# Altium schematic sheet ERN_MainPowerV2.SchDoc
size A; SheetNumber: 1; SheetTotal: 2; SPICEModelCacheJSZPDIHS: <root> / <DocumentId>JSZPDIHS</DocumentId> / <CacheFrame Number="0"> / <Model Name="irf1010" Kind="CKT"> / <Text>*IRF1010 MCE 4-2-96 / *55V  75A .014 ohm HEXFET pkg:TO-220 2,1,3 / .SUBCKT IRF1010  10 20 40 40 / M1   1  2  3  3  DMOS L=1U W=1U / RD  10  1  5.65M / RS  30  3  1.35M / RG  20  2  12.1 / CGS  2  3  2.15N / EGD 12  0  2  1  1 / VFB 14  0  0 / FFB  2  1  VFB  1 / CGD 13 14  4.49N / R1  13  0  1 / D1  12 13  DLIM / DDG 15 14  DCGD / R2  12 15  1 / D2  15  0  DLIM / DSD  3 10  DSUB / LS  30 40  7.5N / .MODEL DMOS NMOS (LEVEL=3 THETA=60M VMAX=114K ETA=2M VTO=3 KP=19.4) / .MODEL DCGD D (CJO=4.49N VJ=.6 M=.68) / .MODEL DSUB D (IS=311N N=1.5 RS=8.67M BV=55 CJO=4.08N VJ=.8 M=.42 TT=100N) / .MODEL DLIM D (IS=100U) / .ENDS IRF1010</Text> / </Model> / <Model Name="led2" Kind="MDL"> / <Text>*Typ RED,GREEN,YELLOW,AMBER GaAs LED: Vf=2.1V Vr=4V If=40mA trr=3uS / *LED Pinout: 1=A, 2=K / .MODEL LED2 D (IS=93.1P RS=42M N=4.61 BV=4 IBV=10U / + CJO=2.97P VJ=.75 M=.333 TT=4.32U)</Text> / </Model> / </CacheFrame> / </root>
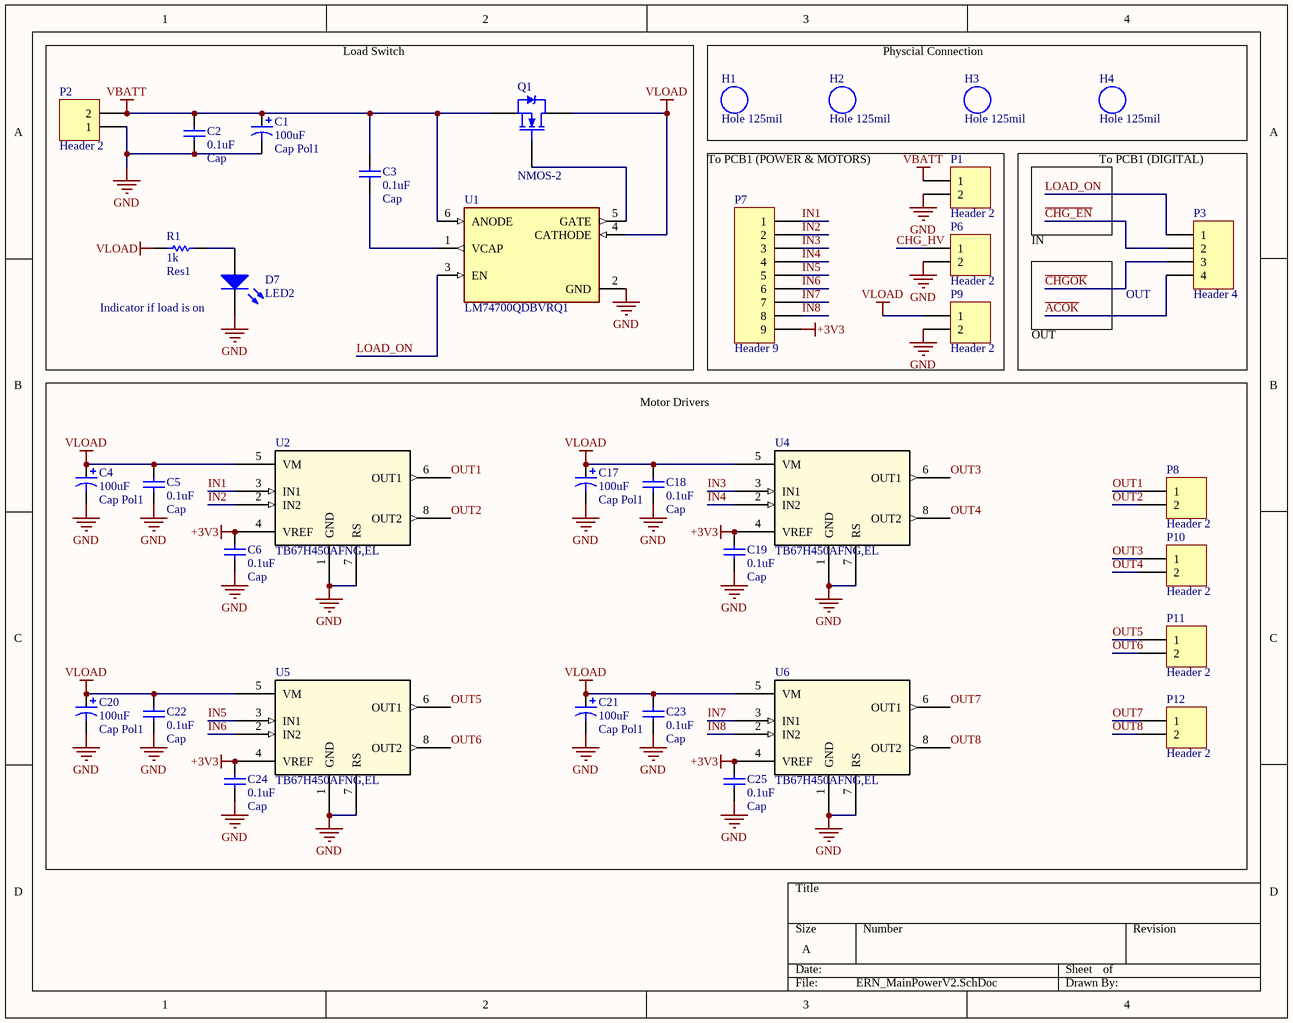
[diagram p0: ERN_MainPowerV2.SchDoc]

## Parts
C1  Cap Pol1  value 100uF  [Cap_47uF_100uF]
C2  Cap  value 0.1uF  [RAD-0.3]
C3  Cap  value 0.1uF  [C0805]
C4  Cap Pol1  value 100uF  [Cap_47uF_100uF]
C5  Cap  value 0.1uF  [C0805]
C6  Cap  value 0.1uF  [RAD-0.3]
C17  Cap Pol1  value 100uF  [Cap_47uF_100uF]
C18  Cap  value 0.1uF  [C0805]
C19  Cap  value 0.1uF  [RAD-0.3]
C20  Cap Pol1  value 100uF  [Cap_47uF_100uF]
C21  Cap Pol1  value 100uF  [Cap_47uF_100uF]
C22  Cap  value 0.1uF  [C0805]
C23  Cap  value 0.1uF  [C0805]
C24  Cap  value 0.1uF  [RAD-0.3]
C25  Cap  value 0.1uF  [RAD-0.3]
D7  LED2  [led-0]
H1  Hole 125mil  [Hole 125mil]
H2  Hole 125mil  [Hole 125mil]
H3  Hole 125mil  [Hole 125mil]
H4  Hole 125mil  [Hole 125mil]
P1  Header 2  [HDR1X2]
P2  Header 2  [HDR1X2]
P3  Header 4  [HDR1X4]
P6  Header 2  [HDR1X2]
P7  Header 9  [HDR1X9]
P8  Header 2  [HDR1X2]
P9  Header 2  [HDR1X2]
P10  Header 2  [HDR1X2]
P11  Header 2  [HDR1X2]
P12  Header 2  [HDR1X2]
Q1  NMOS-2  [TO-220AB]
R1  Res1  value 1k  [AXIAL-0.3]
U1  LM74700QDBVRQ1  [SOT95P280X145-6N]
U2  TB67H450AFNG,EL  [P-HSOP8-0405-1.27-002_TOS]
U4  TB67H450AFNG,EL  [P-HSOP8-0405-1.27-002_TOS]
U5  TB67H450AFNG,EL  [P-HSOP8-0405-1.27-002_TOS]
U6  TB67H450AFNG,EL  [P-HSOP8-0405-1.27-002_TOS]

## Blocks framed on the sheet
Physcial Connection: H1-H4
To PCB1 (POWER & MOTORS): P1 P6 P7 P9
Motor Drivers: C4-C6 C17-C25 P8 P10-P12 U2 U4-U6

## Nets
+3V3: C6.2 C19.2 C24.2 C25.2 P7.9 U2.4(VREF) U4.4(VREF) U5.4(VREF) U6.4(VREF)
GND: C1.2 C2.1 C4.2 C5.1 C6.1 C17.2 C18.1 C19.1 C20.2 C21.2 C22.1 C23.1 C24.1 C25.1 D7.2(K) P1.2 P2.1 P6.2 P9.2 U1.2(GND) U2.1(GND) U2.7(RS) U4.1(GND) U4.7(RS) U5.1(GND) U5.7(RS) U6.1(GND) U6.7(RS)
VBATT: C1.1 C2.2 C3.2 P1.1 P2.2 Q1.3(S) U1.6(ANODE)
VLOAD: C4.1 C5.2 C17.1 C18.2 C20.1 C21.1 C22.2 C23.2 P9.1 Q1.2(D) R1.1 U1.4(CATHODE) U2.5(VM) U4.5(VM) U5.5(VM) U6.5(VM)
~{ACOK}: P3.4
~{CHG_EN}: P3.2
~{CHGOK}: P3.3
CHG_HV: P6.1
IN1: P7.1 U2.3(IN1)
IN2: P7.2 U2.2(IN2)
IN3: P7.3 U4.3(IN1)
IN4: P7.4 U4.2(IN2)
IN5: P7.5 U5.3(IN1)
IN6: P7.6 U5.2(IN2)
IN7: P7.7 U6.3(IN1)
IN8: P7.8 U6.2(IN2)
LOAD_ON: P3.1 U1.3(EN)
OUT1: P8.1 U2.6(OUT1)
OUT2: P8.2 U2.8(OUT2)
OUT3: P10.1 U4.6(OUT1)
OUT4: P10.2 U4.8(OUT2)
OUT5: P11.1 U5.6(OUT1)
OUT6: P11.2 U5.8(OUT2)
OUT7: P12.1 U6.6(OUT1)
OUT8: P12.2 U6.8(OUT2)
NetC3_1: C3.1 U1.1(VCAP)
NetD7_1: D7.1(A) R1.2
NetQ1_1: Q1.1(G) U1.5(GATE)

## Notes on the sheet
- Load Switch
- To PCB1 (DIGITAL)
- IN
- (near P3) OUT
- (near D7) Indicator if load is on
- OUT

## Library data of the parts
C1 C4 C17 C20 C21 = Cap Pol1: Polarized Capacitor (Radial); Published: 8-Jun-2000; LatestRevisionDate: 17-Jul-2002; LatestRevisionNote: Re-released for DXP Platform.; PackageReference: RB7.6-15; Publisher: Altium Limited; PackageDescription: Polarized Capacitor (Radial); 2 Leads
C2 C3 C5 C6 C18 C19 C22-C25 = Cap: Capacitor; Published: 8-Jun-2000; LatestRevisionDate: 17-Jul-2002; LatestRevisionNote: Re-released for DXP Platform.; PackageReference: RAD-0.3; Publisher: Altium Limited; PackageDescription: Radial Cap, Thru-Hole; 2 Leads; 0.3 in Pin Spacing
D7 = LED2: Typical RED, GREEN, YELLOW, AMBER GaAs LED; Published: 8-Jun-2000; LatestRevisionDate: 17-Jul-2002; LatestRevisionNote: Re-released for DXP Platform.; PackageVersion: Feb-2002; PackageReference: 3.2X1.6X1.1; Publisher: Altium Limited; PackageDescription: SM LED; 2 Flat Leads
P1 P2 P6 P8-P12 = Header 2: Header, 2-Pin; LatestRevisionDate: 17-Jul-2002; LatestRevisionNote: Re-released for DXP Platform.; Publisher: Altium Limited
P3 = Header 4: Header, 4-Pin; LatestRevisionDate: 17-Jul-2002; LatestRevisionNote: Re-released for DXP Platform.; Publisher: Altium Limited
P7 = Header 9: Header, 9-Pin; LatestRevisionDate: 17-Jul-2002; LatestRevisionNote: Re-released for DXP Platform.; Publisher: Altium Limited
Q1 = NMOS-2: N-Channel Power MOSFET; Note: Pin 2 is electrically connected to pin 4.; Published: 8-Jun-2000; LatestRevisionDate: 17-Jul-2002; LatestRevisionNote: Re-released for DXP Platform.; DatasheetVersion: PD-9.814; PackageVersion: Feb-1997; PackageReference: TO-220AB; Publisher: Altium Limited; PackageDescription: TO, Thru-Hole, Vertical, Heatsink Mounted; 3 In-Line Leads; Pitch 2.54 mm; ComponentLink1Description: Manufacturer Link; ComponentLink1URL: http://www.irf.com/
R1 = Res1: Resistor; Published: 8-Jun-2000; LatestRevisionDate: 17-Jul-2002; LatestRevisionNote: Re-released for DXP Platform.; PackageReference: AXIAL-0.3; Publisher: Altium Limited; PackageDescription: Axial Device, Thru-Hole; 2 Leads; 0.3 in Pin Spacing
U1 = LM74700QDBVRQ1: 3.2-V to 65-V, 80-uA IQ automotive ideal diode controller; MF: Texas Instruments; SnapEDA_Link: https://www.snapeda.com/parts/LM74700QDBVRQ1/Texas+Instruments/view-part/?ref=snap; Package: SOT-23-6 Texas Instruments; Value: *; MP: LM74700QDBVRQ1; Check_prices: https://www.snapeda.com/parts/LM74700QDBVRQ1/Texas+Instruments/view-part/?ref=eda
U2 U4-U6 = TB67H450AFNG,EL: Toshiba Motor Driver IC; Manufacturer_Name: Toshiba Electronic Devices & Storage Corp.; Copyright: Copyright (C) 2025 Ultra Librarian. All rights reserved.; Manufacturer_Part_Number: TB67H450AFNG,EL; RefDes: RefDes; Type: Type